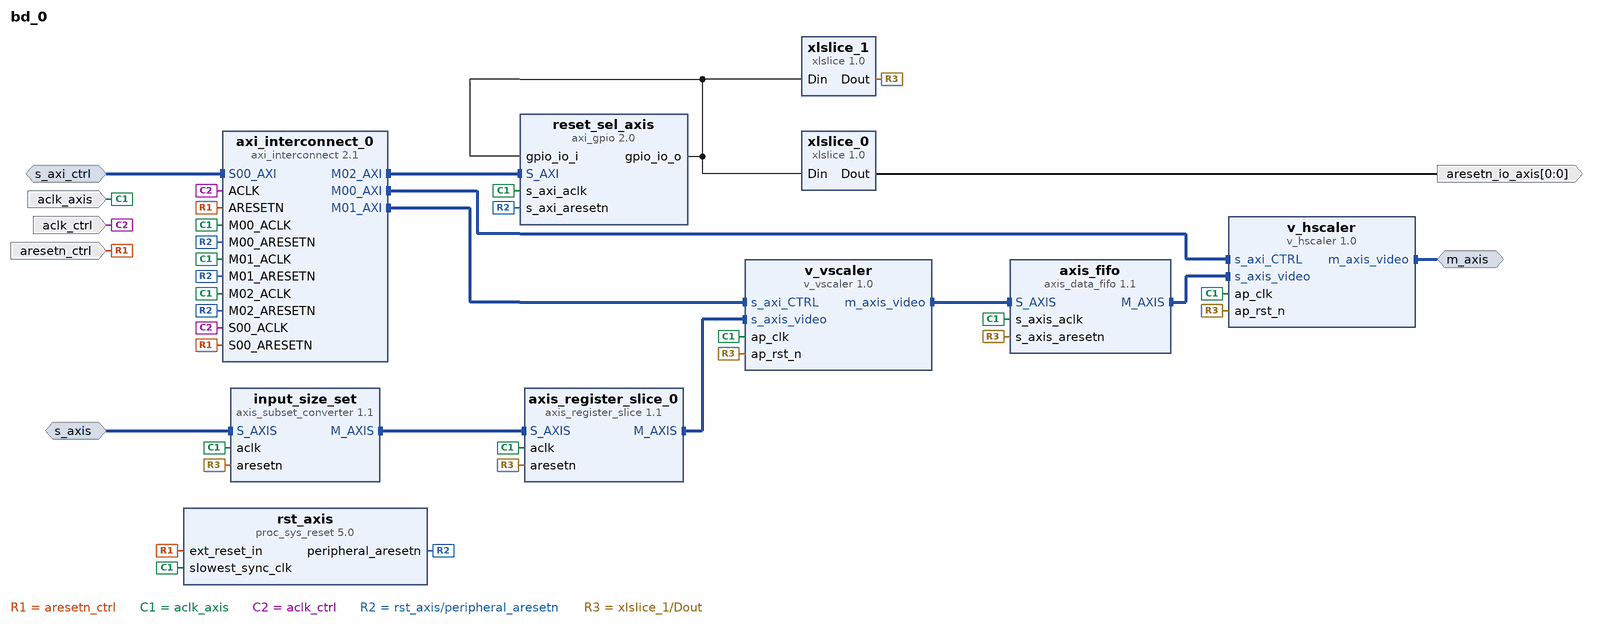
[diagram p0: block diagram of the top level]
# Vivado block design bd_0, Vivado 2015.4
create_bd_design bd_0

create_bd_intf_port -mode Slave -vlnv xilinx.com:interface:aximm_rtl:1.0 s_axi_ctrl
set_property -dict [list \
  CONFIG.PROTOCOL AXI4LITE \
  CONFIG.SUPPORTS_NARROW_BURST 0 \
  CONFIG.MAX_BURST_LENGTH 1 \
] [get_bd_intf_ports s_axi_ctrl]
create_bd_intf_port -mode Slave -vlnv xilinx.com:interface:axis_rtl:1.0 s_axis
set_property -dict {CONFIG.TDATA_NUM_BYTES 3} [get_bd_intf_ports s_axis]
create_bd_intf_port -mode Master -vlnv xilinx.com:interface:axis_rtl:1.0 m_axis
set_property -dict {CONFIG.TDATA_NUM_BYTES 3 CONFIG.HAS_TSTRB 1 CONFIG.HAS_TKEEP 1} [get_bd_intf_ports m_axis]
create_bd_port -dir I -type rst aresetn_ctrl
create_bd_port -dir I -type clk aclk_axis
create_bd_port -dir I -type clk aclk_ctrl
create_bd_port -dir O -from 0 -to 0 -type rst aresetn_io_axis

create_bd_cell -type ip -vlnv xilinx.com:ip:axi_interconnect:2.1 axi_interconnect_0
set_property -dict {CONFIG.NUM_MI 3 CONFIG.STRATEGY 1 CONFIG.S00_HAS_DATA_FIFO 0} [get_bd_cells axi_interconnect_0]
create_bd_cell -type ip -vlnv xilinx.com:ip:v_vscaler:1.0 v_vscaler
set_property -dict [list \
  CONFIG.SAMPLES_PER_CLOCK 1 \
  CONFIG.MAX_COLS 3840 \
  CONFIG.MAX_ROWS 2160 \
  CONFIG.MAX_DATA_WIDTH 8 \
  CONFIG.SCALE_MODE 2 \
  CONFIG.TAPS 8 \
] [get_bd_cells v_vscaler]
create_bd_cell -type ip -vlnv xilinx.com:ip:v_hscaler:1.0 v_hscaler
set_property -dict [list \
  CONFIG.SAMPLES_PER_CLOCK 1 \
  CONFIG.MAX_COLS 3840 \
  CONFIG.MAX_ROWS 2160 \
  CONFIG.MAX_DATA_WIDTH 8 \
  CONFIG.SCALE_MODE 2 \
  CONFIG.TAPS 8 \
] [get_bd_cells v_hscaler]
create_bd_cell -type ip -vlnv xilinx.com:ip:axis_subset_converter:1.1 input_size_set
set_property -dict [list \
  CONFIG.S_TDATA_NUM_BYTES 3 \
  CONFIG.M_TID_WIDTH 1 \
  CONFIG.M_TDEST_WIDTH 1 \
  CONFIG.M_HAS_TSTRB 1 \
  CONFIG.M_HAS_TKEEP 1 \
] [get_bd_cells input_size_set]
create_bd_cell -type ip -vlnv xilinx.com:ip:proc_sys_reset:5.0 rst_axis
create_bd_cell -type ip -vlnv xilinx.com:ip:axi_gpio:2.0 reset_sel_axis
set_property -dict {CONFIG.C_GPIO_WIDTH 2} [get_bd_cells reset_sel_axis]
create_bd_cell -type ip -vlnv xilinx.com:ip:axis_register_slice:1.1 axis_register_slice_0
create_bd_cell -type ip -vlnv xilinx.com:ip:axis_data_fifo:1.1 axis_fifo
set_property -dict {CONFIG.FIFO_DEPTH 1024} [get_bd_cells axis_fifo]
create_bd_cell -type ip -vlnv xilinx.com:ip:xlslice:1.0 xlslice_0
set_property -dict {CONFIG.DOUT_WIDTH 1 CONFIG.DIN_TO 0 CONFIG.DIN_FROM 0 CONFIG.DIN_WIDTH 2} [get_bd_cells xlslice_0]
create_bd_cell -type ip -vlnv xilinx.com:ip:xlslice:1.0 xlslice_1
set_property -dict {CONFIG.DOUT_WIDTH 1 CONFIG.DIN_TO 1 CONFIG.DIN_FROM 1 CONFIG.DIN_WIDTH 2} [get_bd_cells xlslice_1]

# ---- connections ----

connect_bd_intf_net -intf_net intf_net_axi_interconnect_0_M00_AXI [get_bd_intf_pins axi_interconnect_0/M00_AXI] [get_bd_intf_pins v_hscaler/s_axi_CTRL]
connect_bd_intf_net -intf_net intf_net_axi_interconnect_0_M01_AXI [get_bd_intf_pins axi_interconnect_0/M01_AXI] [get_bd_intf_pins v_vscaler/s_axi_CTRL]
connect_bd_intf_net -intf_net intf_net_axi_interconnect_0_M02_AXI [get_bd_intf_pins axi_interconnect_0/M02_AXI] [get_bd_intf_pins reset_sel_axis/S_AXI]
connect_bd_intf_net -intf_net intf_net_input_size_set_M_AXIS [get_bd_intf_pins input_size_set/M_AXIS] [get_bd_intf_pins axis_register_slice_0/S_AXIS]
connect_bd_intf_net -intf_net intf_net_axis_register_slice_0_M_AXIS [get_bd_intf_pins axis_register_slice_0/M_AXIS] [get_bd_intf_pins v_vscaler/s_axis_video]
connect_bd_intf_net -intf_net intf_net_v_vscaler_m_axis_video [get_bd_intf_pins v_vscaler/m_axis_video] [get_bd_intf_pins axis_fifo/S_AXIS]
connect_bd_intf_net -intf_net intf_net_axis_fifo_M_AXIS [get_bd_intf_pins axis_fifo/M_AXIS] [get_bd_intf_pins v_hscaler/s_axis_video]
connect_bd_intf_net -intf_net intf_net_bdry_in_s_axi_ctrl [get_bd_intf_ports s_axi_ctrl] [get_bd_intf_pins axi_interconnect_0/S00_AXI]
connect_bd_intf_net -intf_net intf_net_bdry_in_s_axis [get_bd_intf_ports s_axis] [get_bd_intf_pins input_size_set/S_AXIS]
connect_bd_intf_net -intf_net intf_net_v_hscaler_m_axis_video [get_bd_intf_ports m_axis] [get_bd_intf_pins v_hscaler/m_axis_video]
connect_bd_net -net net_bdry_in_aresetn_ctrl [get_bd_ports aresetn_ctrl] \
  [get_bd_pins rst_axis/ext_reset_in] [get_bd_pins axi_interconnect_0/ARESETN] [get_bd_pins axi_interconnect_0/S00_ARESETN]
connect_bd_net -net net_bdry_in_aclk_axis [get_bd_ports aclk_axis] \
  [get_bd_pins v_vscaler/ap_clk] [get_bd_pins v_hscaler/ap_clk] [get_bd_pins axis_register_slice_0/aclk] \
  [get_bd_pins axis_fifo/s_axis_aclk] [get_bd_pins rst_axis/slowest_sync_clk] [get_bd_pins reset_sel_axis/s_axi_aclk] \
  [get_bd_pins input_size_set/aclk] [get_bd_pins axi_interconnect_0/M00_ACLK] [get_bd_pins axi_interconnect_0/M01_ACLK] \
  [get_bd_pins axi_interconnect_0/M02_ACLK]
connect_bd_net -net net_bdry_in_aclk_ctrl [get_bd_ports aclk_ctrl] [get_bd_pins axi_interconnect_0/ACLK] [get_bd_pins axi_interconnect_0/S00_ACLK]
connect_bd_net -net net_rst_axis_peripheral_aresetn [get_bd_pins rst_axis/peripheral_aresetn] \
  [get_bd_pins reset_sel_axis/s_axi_aresetn] [get_bd_pins axi_interconnect_0/M00_ARESETN] \
  [get_bd_pins axi_interconnect_0/M01_ARESETN] [get_bd_pins axi_interconnect_0/M02_ARESETN]
connect_bd_net -net net_reset_sel_axis_gpio_io_i [get_bd_pins reset_sel_axis/gpio_io_o] \
  [get_bd_pins reset_sel_axis/gpio_io_i] [get_bd_pins xlslice_0/Din] [get_bd_pins xlslice_1/Din]
connect_bd_net -net net_xlslice_0_Dout [get_bd_pins xlslice_0/Dout] [get_bd_ports aresetn_io_axis]
connect_bd_net -net net_xlslice_1_Dout [get_bd_pins xlslice_1/Dout] \
  [get_bd_pins v_hscaler/ap_rst_n] [get_bd_pins v_vscaler/ap_rst_n] [get_bd_pins axis_register_slice_0/aresetn] \
  [get_bd_pins input_size_set/aresetn] [get_bd_pins axis_fifo/s_axis_aresetn]

# ---- address map ----
assign_bd_address -offset 0x00000 -range 64K -target_address_space [get_bd_addr_spaces s_axi_ctrl] [get_bd_addr_segs reset_sel_axis/S_AXI/Reg]
assign_bd_address -offset 0x10000 -range 64K -target_address_space [get_bd_addr_spaces s_axi_ctrl] [get_bd_addr_segs v_hscaler/s_axi_CTRL/Reg]
assign_bd_address -offset 0x20000 -range 64K -target_address_space [get_bd_addr_spaces s_axi_ctrl] [get_bd_addr_segs v_vscaler/s_axi_CTRL/Reg]

validate_bd_design
save_bd_design
